# EAGLE design Singularity (EAGLE 5.00)
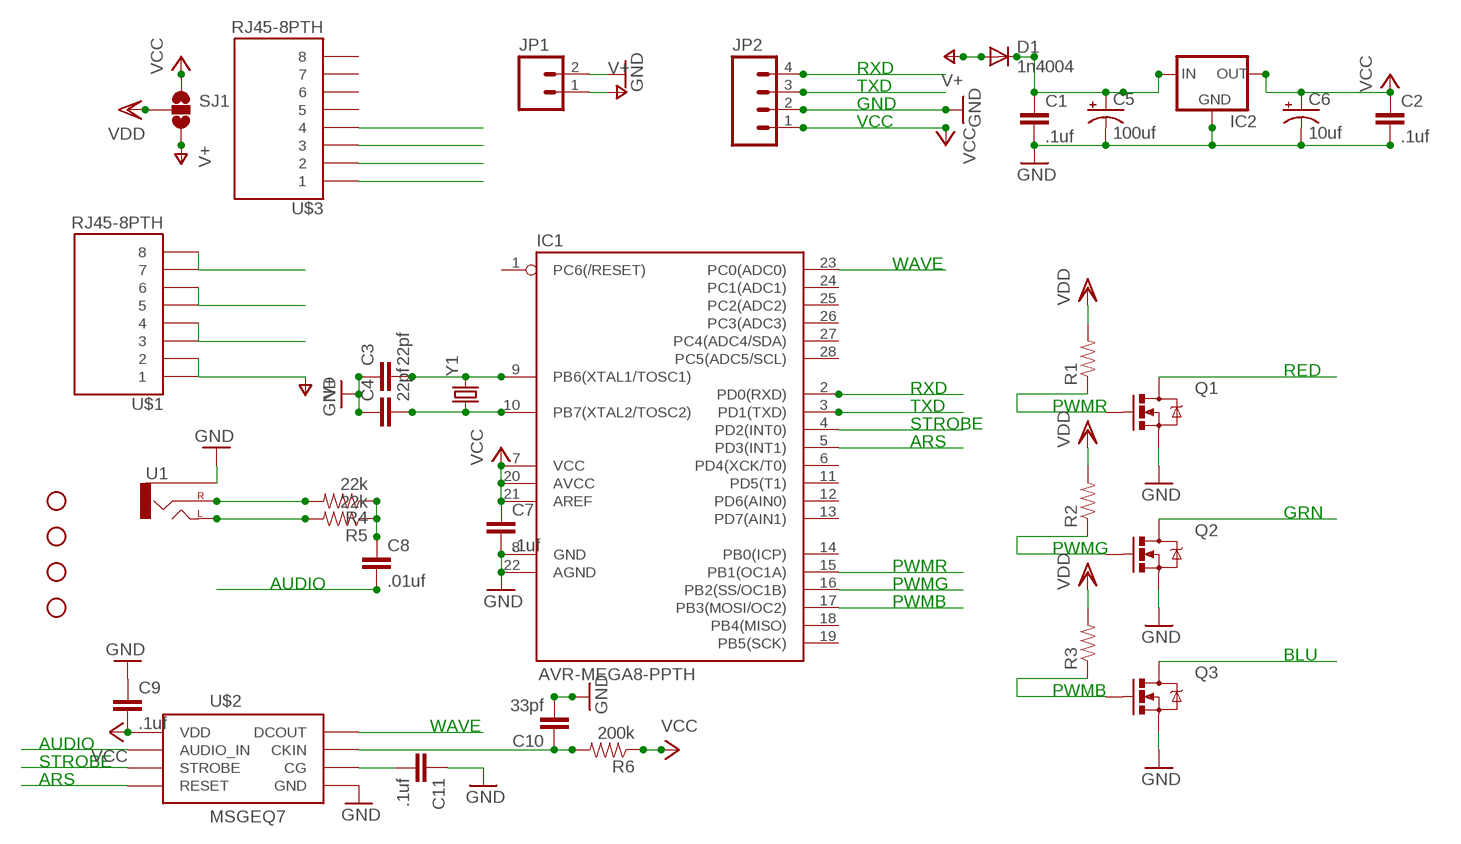
[diagram p0: schematic, sheet 1]

## Parts
C1  .1uf  CAPPTH  [CAP-PTH-SMALL]
C2  .1uf  CAPPTH  [CAP-PTH-SMALL]
C3  22pf  CAPPTH  [CAP-PTH-SMALL]
C4  22pf  CAPPTH  [CAP-PTH-SMALL]
C5  100uf  CAP_POLPTH1  [CPOL-RADIAL-100UF-25V]
C6  10uf  CAP_POLPTH2  [CPOL-RADIAL-10UF-25V]
C7  .1uf  CAPPTH  [CAP-PTH-SMALL]
C8  .01uf  CAPPTH  [CAP-PTH-SMALL]
C9  .1uf  CAPPTH  [CAP-PTH-SMALL]
C10  33pf  CAPPTH  [CAP-PTH-SMALL]
C11  .1uf  CAPPTH  [CAP-PTH-SMALL]
D1  1n4004  DIODEPTH  [DIODE-1N4001]
IC1  AVR-MEGA8-PPTH  [DIL28-3]
IC2  V_REG_78XXTO-92  [TO-92]
JP1  M025MM  [SCREWTERMINAL-5MM-2]
JP2  M04LOCK  [1X04_LOCK]
JP10  STAND-OFF  [STAND-OFF]
JP11  STAND-OFF  [STAND-OFF]
JP12  STAND-OFF  [STAND-OFF]
JP13  STAND-OFF  [STAND-OFF]
Q1  MOSFET-NCHANNELPTH2  [TO220V]
Q2  MOSFET-NCHANNELPTH2  [TO220V]
Q3  MOSFET-NCHANNELPTH2  [TO220V]
R1  RESISTORPTH-1/4W  [AXIAL-0.4]
R2  RESISTORPTH-1/4W  [AXIAL-0.4]
R3  RESISTORPTH-1/4W  [AXIAL-0.4]
R4  22k  RESISTORPTH-1/4W  [AXIAL-0.4]
R5  22k  RESISTORPTH-1/4W  [AXIAL-0.4]
R6  200k  RESISTORPTH-1/4W  [AXIAL-0.4]
SJ1  SOLDERJUMPER_2WAYW  [SJ_2W]
U1  AUDIO-JACKPTH  [AUDIO-JACK]
U$1  RJ45-8PTH  [RJ45-8]
U$2  MSGEQ7_PTH  [DIL08]
U$3  RJ45-8PTH  [RJ45-8]
Y1  CRYSTALHC49US  [HC49US]

## Nets
ARS: IC1.5(PD3(INT1)) U$2.7(RESET)
AUDIO: C8.2 U$2.5(AUDIO_IN)
BLU: Q3.2(D) U$1.3 U$1.4
GND: C1.2 C2.2 C3.1 C4.1 C5.2(-) C6.2(-) C7.2 C9.1 C10.2 C11.1 IC1.8(GND) IC1.22(AGND) IC2.1(GND) JP1.2 JP2.2 Q1.3(S) Q2.3(S) Q3.3(S) U1.SLEEVE U$2.2(GND) U$3.2
GRN: Q2.2(D) U$1.5 U$1.6
N$1: R4.P$2 U1.RING(RIGHT)
N$2: R5.P$2 U1.TIP(LEFT)
N$4: C8.1 R4.P$1 R5.P$1
N$5: C10.1 R6.P$2 U$2.8(CKIN)
N$6: C11.2 U$2.6(CG)
N$12: C1.1 C5.1(+) D1.C IC2.2(IN)
N$21: C4.2 IC1.10(PB7(XTAL2/TOSC2)) Y1.1
N$22: C3.2 IC1.9(PB6(XTAL1/TOSC1)) Y1.2
PWMB: IC1.17(PB3(MOSI/OC2)) Q3.1(G) R3.P$1
PWMG: IC1.16(PB2(SS/OC1B)) Q2.1(G) R2.P$1
PWMR: IC1.15(PB1(OC1A)) Q1.1(G) R1.P$1
RED: Q1.2(D) U$1.7 U$1.8
RXD: IC1.2(PD0(RXD)) JP2.4 U$3.4
STROBE: IC1.4(PD2(INT0)) U$2.4(STROBE)
TXD: IC1.3(PD1(TXD)) JP2.3 U$3.3
V+: D1.A JP1.1 SJ1.3 U$1.1 U$1.2
VCC: C2.1 C6.1(+) C7.1 C9.2 IC1.7(VCC) IC1.20(AVCC) IC1.21(AREF) IC2.3(OUT) JP2.1 R6.P$1 SJ1.1 U$2.1(VDD) U$3.1
VDD: R1.P$2 R2.P$2 R3.P$2 SJ1.2
WAVE: IC1.23(PC0(ADC0)) U$2.3(DCOUT)
Unconnected: IC1.1(PC6(/RESET)) IC1.6(PD4(XCK/T0)) IC1.11(PD5(T1)) IC1.12(PD6(AIN0)) IC1.13(PD7(AIN1)) IC1.14(PB0(ICP)) IC1.18(PB4(MISO)) IC1.19(PB5(SCK)) IC1.24(PC1(ADC1)) IC1.25(PC2(ADC2)) IC1.26(PC3(ADC3)) IC1.27(PC4(ADC4/SDA)) IC1.28(PC5(ADC5/SCL)) U$3.5 U$3.6 U$3.7 U$3.8

## Notes on the sheet
- RXD
- TXD
- GND
- VCC
- WAVE
- RED
- RXD
- TXD | PWMR
- STROBE
- ARS
- GRN
- PWMG
- PWMR
- AUDIO | PWMG
- PWMB
- BLU
- PWMB
- WAVE
- AUDIO
- STROBE
- ARS

## Library data of the parts
C1-C4 C7-C11 = SparkFun:CAP: Capacitor Standard 0603 ceramic capacitor, and 0.1" leaded capacitor.
C5 C6 = SparkFun:CAP_POL: Capacitor Polarized These are standard SMD and PTH capacitors. Normally 10uF, 47uF, and 100uF in electrolytic and tantalum varieties. Always verify the external diameter of the through hole cap, it varies with capacity, voltage, and manufacturer. The EIA devices should be standard.
D1 = SparkFun:DIODE: Diode These are standard reverse protection diodes and small signal diodes. SMA package can handle up to about 1A. SOD-323 can handle about 200mA. What the SOD-323 package when ordering, there are some mfgs out there that are 5-pin packages.
IC1 = SparkFun:AVR-MEGA8-P: MICROCONTROLLER 8 Kbytes FLASH 1 kbytes SRAM 512 bytes EEPROM USART 4-channel 10 bit ADC 2-channel 8 bit ADC
IC2 = SparkFun:V_REG_78XX: Voltage Regulator Standard 7805 5V regulator. IGO (Input Ground Output). Spark Fun Electronics SKU : COM-00107
JP1 = SparkFun:M02: Header 2 Standard 2-pin 0.1" header. Use with straight break away headers (SKU : PRT-00116), right angle break away headers (PRT-00553), swiss pins (PRT-00743), machine pins (PRT-00117), and female headers (PRT-00115). Molex polarized connector foot print use with SKU : PRT-08233 with associated crimp pins and housings.
JP2 = SparkFun:M04: Header 4 Standard 4-pin 0.1" header. Use with straight break away headers (SKU : PRT-00116), right angle break away headers (PRT-00553), swiss pins (PRT-00743), machine pins (PRT-00117), and female headers (PRT-00115). Molex polarized connector foot print use with SKU : PRT-08231 with associated crimp pins and housings. 1MM SMD Version SKU: PRT-10208
JP10-JP13 = SparkFun:STAND-OFF: Stand Off This is the mechanical footprint for a #4 phillips button head screw. Use the keepout ring to avoid running the screw head into surrounding components. SKU : PRT-00447
Q1-Q3 = SparkFun:MOSFET-NCHANNEL
R1-R6 = SparkFun:RESISTOR: Resistor Basic schematic elements and footprints for 0603, 1206, and PTH resistors.
SJ1 = SparkFun:SOLDERJUMPER_2WAY: Solder Jumper 2 way solder jumper
U1 = SparkFun:AUDIO-JACK: 3.5mm Audio Jack Simple 3.5mm common PCB mount audio jack. SKU: PRT-08032
U$1 U$3 = SparkFun:RJ45-8: RJ45 Jack Simple RJ45, 8-pin connection - connector for common Cat5, Cat5e, and Cat6 Ethernet cables. Footprint not yet proven in production. Connector sku is PRT-00643; Breakout PCB sku is BOB-00716.
U$2 = SparkFun:MSGEQ7_PTH
Y1 = SparkFun:CRYSTAL: Crystals Various standard crystals. Proven footprints. Spark Fun Electronics SKU : COM-00534

## Board
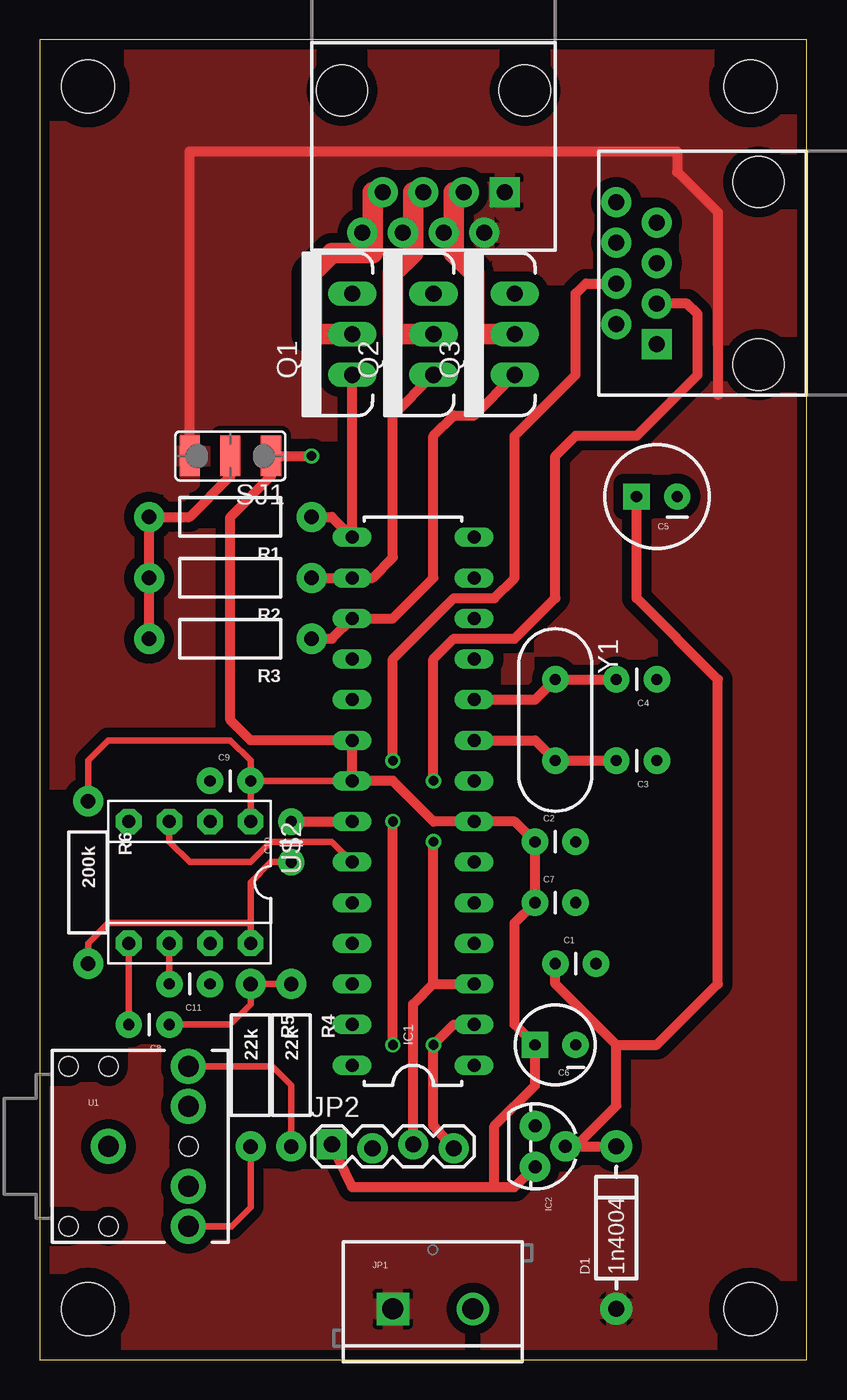
[diagram p1: board, top side]
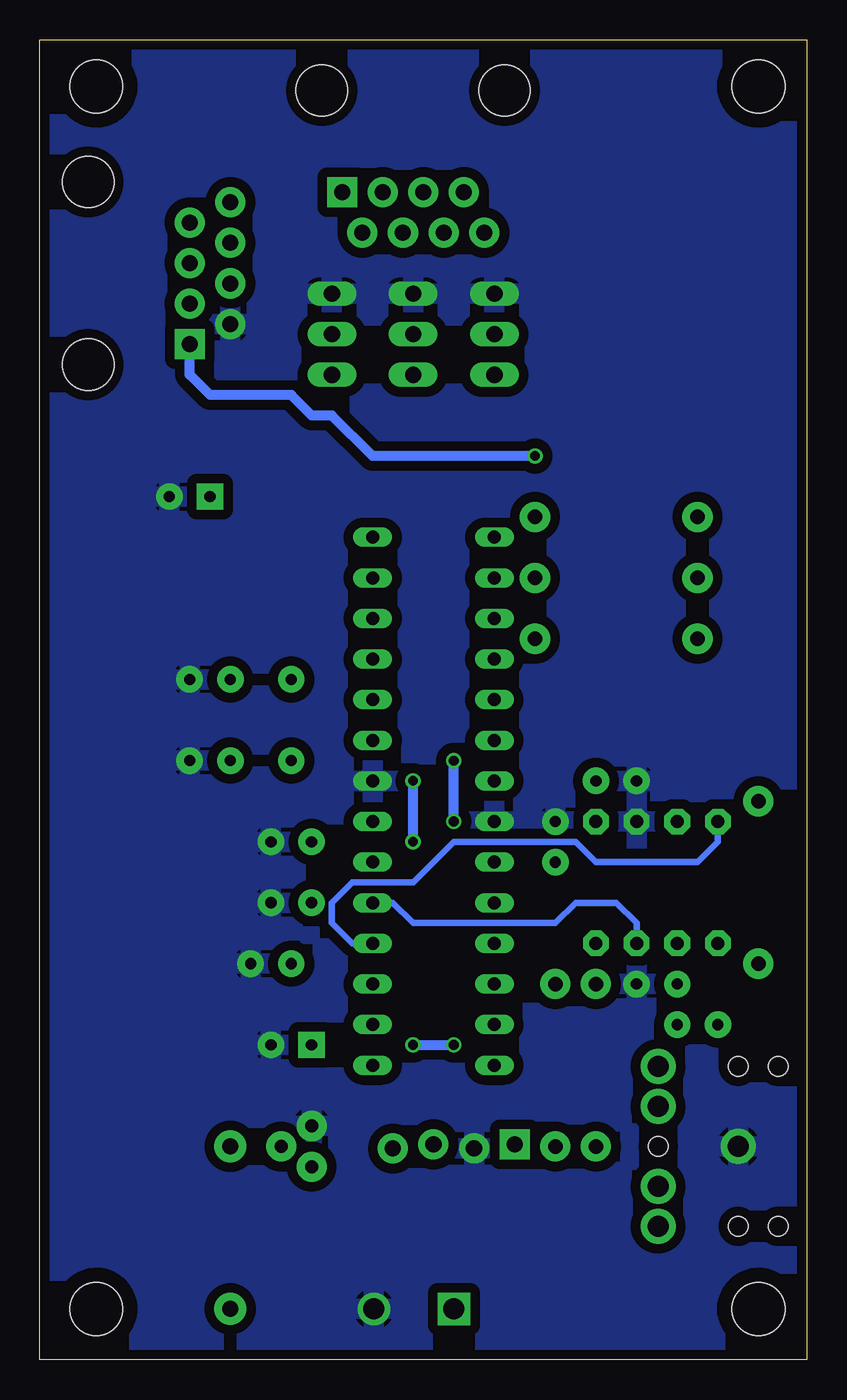
[diagram p2: board, bottom side, seen from below]

Size 47.93 x 82.53 mm. Coordinates in mm from the lower left corner, seen from the top.
Outline: 47.93,0 47.93,82.53 0,82.53 0,0 47.93,0
Copper layers (1*16): Top 0.0356mm / dielectric 1.5011mm / Bottom 0.0356mm
Design rules "LaenPCBOrder (1)": minimum track width 6mil, minimum drill 13mil, track to track 6mil, track to pad 6mil, pad to pad 6mil, via to via 6mil, smd to smd 6mil, copper to edge 15mil, drill to drill 6mil, minimum pad ring 7mil, minimum via ring 7mil, stop-mask expansion 4mil, vias tented up to drill 0mil, thermal gap 10mil

### Footprints (pad centres in the part's own frame; a part is rotated, then mirrored left to right if it is on the bottom)
CAP-PTH-SMALL = drill 0.7 pad 1.651 round: 1 0,0; 2 2.54,0
CPOL-RADIAL-100UF-25V = drill 0.7 pad 1.651 square: 1 1.27,0 | drill 0.7 pad 1.651 round: 2 -1.27,0
CPOL-RADIAL-10UF-25V = drill 0.7 pad 1.651 square: 1 1.27,0 | drill 0.7 pad 1.651 round: 2 -1.27,0
DIODE-1N4001 = drill 1 pad 1.981 round: A -5.08,0; C 5.08,0
DIL28-3 = drill 0.813 long: 1 -16.51,-3.81; 2 -13.97,-3.81; 3 -11.43,-3.81; 4 -8.89,-3.81; 5 -6.35,-3.81; 6 -3.81,-3.81; 7 -1.27,-3.81; 8 1.27,-3.81; 9 3.81,-3.81; 10 6.35,-3.81; 11 8.89,-3.81; 12 11.43,-3.81; 13 13.97,-3.81; 14 16.51,-3.81; 15 16.51,3.81; 16 13.97,3.81; 17 11.43,3.81; 18 8.89,3.81; 19 6.35,3.81; 20 3.81,3.81; 21 1.27,3.81; 22 -1.27,3.81; 23 -3.81,3.81; 24 -6.35,3.81; 25 -8.89,3.81; 26 -11.43,3.81; 27 -13.97,3.81; 28 -16.51,3.81
TO-92 = drill 0.813 pad 1.88 round: 1 -1.27,0; 2 0,1.905; 3 1.27,0
SCREWTERMINAL-5MM-2 = drill 1.3 pad 2.032 square: 1 0,0 | drill 1.3 pad 2.032 round: 2 5,0
1X04_LOCK = drill 1.016 pad 1.88 square: 1 0,0.127 | drill 1.016 pad 1.88 round: 2 2.54,-0.127; 3 5.08,0.127; 4 7.62,-0.127
STAND-OFF = hole 3.302: 0,0
TO220V = drill 1.016 long: 1 -2.54,0; 2 0,0; 3 2.54,0
AXIAL-0.4 = drill 0.9 pad 1.88 round: P$1 -5.08,0; P$2 5.08,0
SJ_2W = smd 1.27 x 2.54: 1 -2.54,0; 2 0,0; 3 2.54,0
AUDIO-JACK = drill 1.3 pad 2.184 round: RING 5,5; RSH 5,2.5; SLEEVE 0,0; TIP 5,-5; TSH 5,-2.5 | hole 1.2: 0,5; -2.5,5; -2.5,-5; 0,-5; 5,0
RJ45-8 = drill 1 pad 1.88 square: 1 -4.445,6.35 | drill 1 pad 1.88 round: 2 -3.175,8.89; 3 -1.905,6.35; 4 -0.635,8.89; 5 0.635,6.35; 6 1.905,8.89; 7 3.175,6.35; 8 4.445,8.89 | hole 3.2: -5.715,0; 5.715,0
DIL08 = drill 0.813 pad 1.6 octagon: 1 -3.81,-3.81; 2 -1.27,-3.81; 3 1.27,-3.81; 4 3.81,-3.81; 5 3.81,3.81; 6 1.27,3.81; 7 -1.27,3.81; 8 -3.81,3.81
HC49US = drill 0.7 pad 1.651 round: 1 -2.54,0; 2 2.54,0

### Placement (x,y rotation side)
C1  32.22,24.76 0 top
C2  30.95,32.38 0 top
C3  38.57,37.46 180 top
C4  38.57,42.54 180 top
C5  38.57,53.97 180 top
C6  32.22,19.68 180 top
C7  30.95,28.57 0 top
C8  8.09,20.95 180 top
C9  10.63,36.19 0 top
C10  15.71,31.11 90 top
C11  10.63,23.49 180 top
D1  36.03,8.25 90 top
IC1  23.33,34.92 90 top
IC2  30.95,13.33 270 top
JP1  22.06,3.17 0 top
JP2  18.25,13.33 0 top
JP10  3.01,3.17 0 top
JP11  44.41,3.17 0 top
JP12  3.01,79.62 0 top
JP13  44.41,79.62 0 top
Q1  19.52,64.13 90 top
Q2  24.6,64.13 90 top
Q3  29.68,64.13 90 top
R1  11.9,52.7 180 top
R2  11.9,48.89 180 top
R3  11.9,45.08 180 top
R4  15.71,18.41 270 top
R5  13.17,18.41 270 top
R6  3.01,29.84 270 top
SJ1  11.9,56.51 180 top
U1  4.28,13.33 0 top
U$1  24.6,79.37 180 top
U$2  9.36,29.84 180 top
U$3  44.92,67.94 90 top
Y1  32.22,40 270 top

### Tracks (layer width: path | path; a pad name or v marks a point on that pad's centre or on a via)
ARS
  Bottom 0.406: IC1.5 25.87,28.57 24.6,27.3 15.71,27.3 14.44,28.57 11.9,28.57 10.63,27.3 U$2.7
AUDIO
  Top 0.406: C8.2 U$2.5
BLU
  Top 1.27: Q3.2 27.14,64.13 27.14,67.94 25.87,69.21 25.87,70.48 | 25.87,70.48 25.87,73.02 U$1.3 | 25.87,70.48 U$1.4
GND
  Top 0.61: C10.2 IC1.22
  pour Bottom (isolate 0.61): 0.47,81.91 47.46,81.91 47.46,0.63 1.74,0.63 0.47,0.63
GRN
  Top 1.27: Q2.2 22.06,64.13 22.06,67.94 23.33,69.21 23.33,70.48 | 23.33,70.48 23.33,73.02 U$1.5 | 23.33,70.48 U$1.6
N$1
  Top 0.406: U1.RING 14.52,18.33 15.71,17.14 R4.P$2
N$2
  Top 0.406: U1.TIP 11.98,8.33 13.17,9.52 R5.P$2
N$4
  Top 0.406: R4.P$1 R5.P$1 13.17,22.22 11.9,20.95 C8.1
N$5
  Top 0.406: 13.17,27.3 U$2.8 | 13.17,27.3 4.28,27.3 3.01,26.03 R6.P$2 | C10.1 14.44,31.11 13.17,29.84 13.17,27.3
N$6
  Top 0.406: C11.2 U$2.6
N$12
  Top 0.61: C1.1 32.22,23.49 36.03,19.68 | 36.03,19.68 36.03,15.87 33.49,13.33 | 32.22,13.33 IC2.2 33.49,13.33 | 33.49,13.33 D1.C | C5.1 37.3,47.62 42.38,42.54 42.38,23.49 38.57,19.68 36.03,19.68
N$21
  Top 0.61: IC1.10 30.95,41.27 Y1.1 C4.2
N$22
  Top 0.61: IC1.9 30.95,38.73 Y1.2 C3.2
PWMB
  Top 0.61: R3.P$1 18.25,45.08 IC1.17 22.06,46.35 24.6,48.89 24.6,57.78 25.87,59.05 27.14,59.05 Q3.1
PWMG
  Top 0.61: R2.P$1 IC1.16 20.79,48.89 22.06,50.16 22.06,59.05 Q2.1
PWMR
  Top 0.61: R1.P$1 18.25,52.7 IC1.15 Q1.1
RED
  Top 1.27: Q1.2 16.98,64.13 16.98,67.94 18.25,69.21 20.79,69.21 20.79,70.48 | 20.79,70.48 20.79,73.02 U$1.7 | 20.79,70.48 U$1.8
RXD  (via drill 0.6)
  Top 0.61: JP2.4 24.6,14.6 v24.6,19.68 25.87,20.95 IC1.2 | U$3.4 34.12,67.31 33.49,66.67 33.49,61.59 29.68,57.78 29.68,48.89 28.41,47.62 25.87,47.62 22.06,43.81 v22.06,37.46 | v22.06,19.68 v22.06,33.65
  Bottom 0.61: v22.06,33.65 v22.06,37.46 | v24.6,19.68 v22.06,19.68
STROBE
  Bottom 0.406: U$2.4 5.55,32.38 6.82,31.11 13.17,31.11 14.44,32.38 22.06,32.38 24.6,29.84 28.41,29.84 29.68,28.57 29.68,27.3 28.41,26.03 IC1.4
TXD  (via drill 0.6)
  Top 0.61: JP2.3 23.33,22.22 24.6,23.49 | 24.6,23.49 IC1.3 | U$3.3 40.48,66.03 41.11,65.4 41.11,61.59 37.3,57.78 33.49,57.78 32.22,56.51 32.22,47.62 29.68,45.08 25.87,45.08 24.6,43.81 v24.6,36.19 | 24.6,23.49 v24.6,32.38
  Bottom 0.61: v24.6,32.38 v24.6,36.19
V+
  Top 0.61: SJ1.3 9.36,75.56 39.84,75.56 39.84,74.29 42.38,71.75 42.38,60.32
  pour Top (isolate 0.61): 0.47,81.91 47.46,81.91 47.46,0.63 0.47,0.63
VCC  (via drill 0.6)
  Top 0.406: C9.2 U$2.1 | IC1.21 C9.2 | C9.2 13.17,37.46 11.9,38.73 4.28,38.73 3.01,37.46 R6.P$1 | 14.44,55.24 SJ1.1
  Top 0.61: JP2.1 19.52,10.79 28.41,10.79 | 28.41,10.79 29.68,10.79 IC2.3 | 28.41,10.79 28.41,14.6 30.95,17.14 C6.1 29.68,20.95 29.68,27.3 C7.1 C2.1 29.68,33.65 IC1.7 24.6,33.65 22.06,36.19 IC1.21 IC1.20 13.17,38.73 11.9,40 11.9,52.7 14.44,55.24 | SJ1.1 v16.98,56.51
  Bottom 0.61: U$3.1 38.57,61.59 37.3,60.32 32.22,60.32 30.95,59.05 29.68,59.05 27.14,56.51 v16.98,56.51
VDD
  Top 0.406: 11.9,55.24 SJ1.2
  Top 0.61: R3.P$2 R2.P$2 R1.P$2 9.36,52.7 11.9,55.24
WAVE
  Top 0.406: IC1.23 18.25,32.38 14.44,32.38 13.17,31.11 9.36,31.11 8.09,32.38 U$2.3